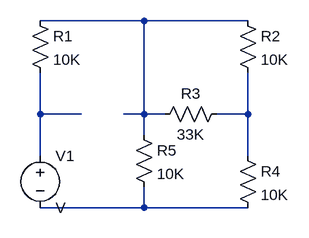
[diagram p0: schematic Thevenin.asc]
Thevenin.asc, the LTspice schematic file:
Version 4
SHEET 1 880 680
WIRE 176 64 16 64
WIRE 336 64 176 64
WIRE 16 208 16 144
WIRE 80 208 16 208
WIRE 176 208 176 64
WIRE 176 208 144 208
WIRE 208 208 176 208
WIRE 336 208 336 144
WIRE 336 208 288 208
WIRE 176 240 176 208
WIRE 16 272 16 208
WIRE 336 272 336 208
WIRE 176 352 176 320
WIRE 176 352 16 352
WIRE 336 352 176 352
SYMBOL res 0 48 R0
SYMATTR InstName R1
SYMATTR Value 10K
SYMBOL res 320 48 R0
SYMATTR InstName R2
SYMATTR Value 10K
SYMBOL res 304 192 R90
WINDOW 0 0 56 VBottom 2
WINDOW 3 32 56 VTop 2
SYMATTR InstName R3
SYMATTR Value 33K
SYMBOL voltage 16 256 R0
SYMATTR InstName V1
SYMBOL res 320 256 R0
SYMATTR InstName R4
SYMATTR Value 10K
SYMBOL res 160 224 R0
SYMATTR InstName R5
SYMATTR Value 10K

The netlist it stands for:
* Thevenin.asc
R1 N001 N002 10K
R2 N001 N003 10K
R3 N003 N001 33K
V1 N002 N004 V
R4 N003 N004 10K
R5 N001 N004 10K
.backanno
.end